# EasyEDA schematic Fyp_SCH_FINAL.json
TITLE: Sheet_1; REV: 1.0; Date: 2023-05-06; Sheet: 1/1; Drawn By: supunchira; Company: Your Company
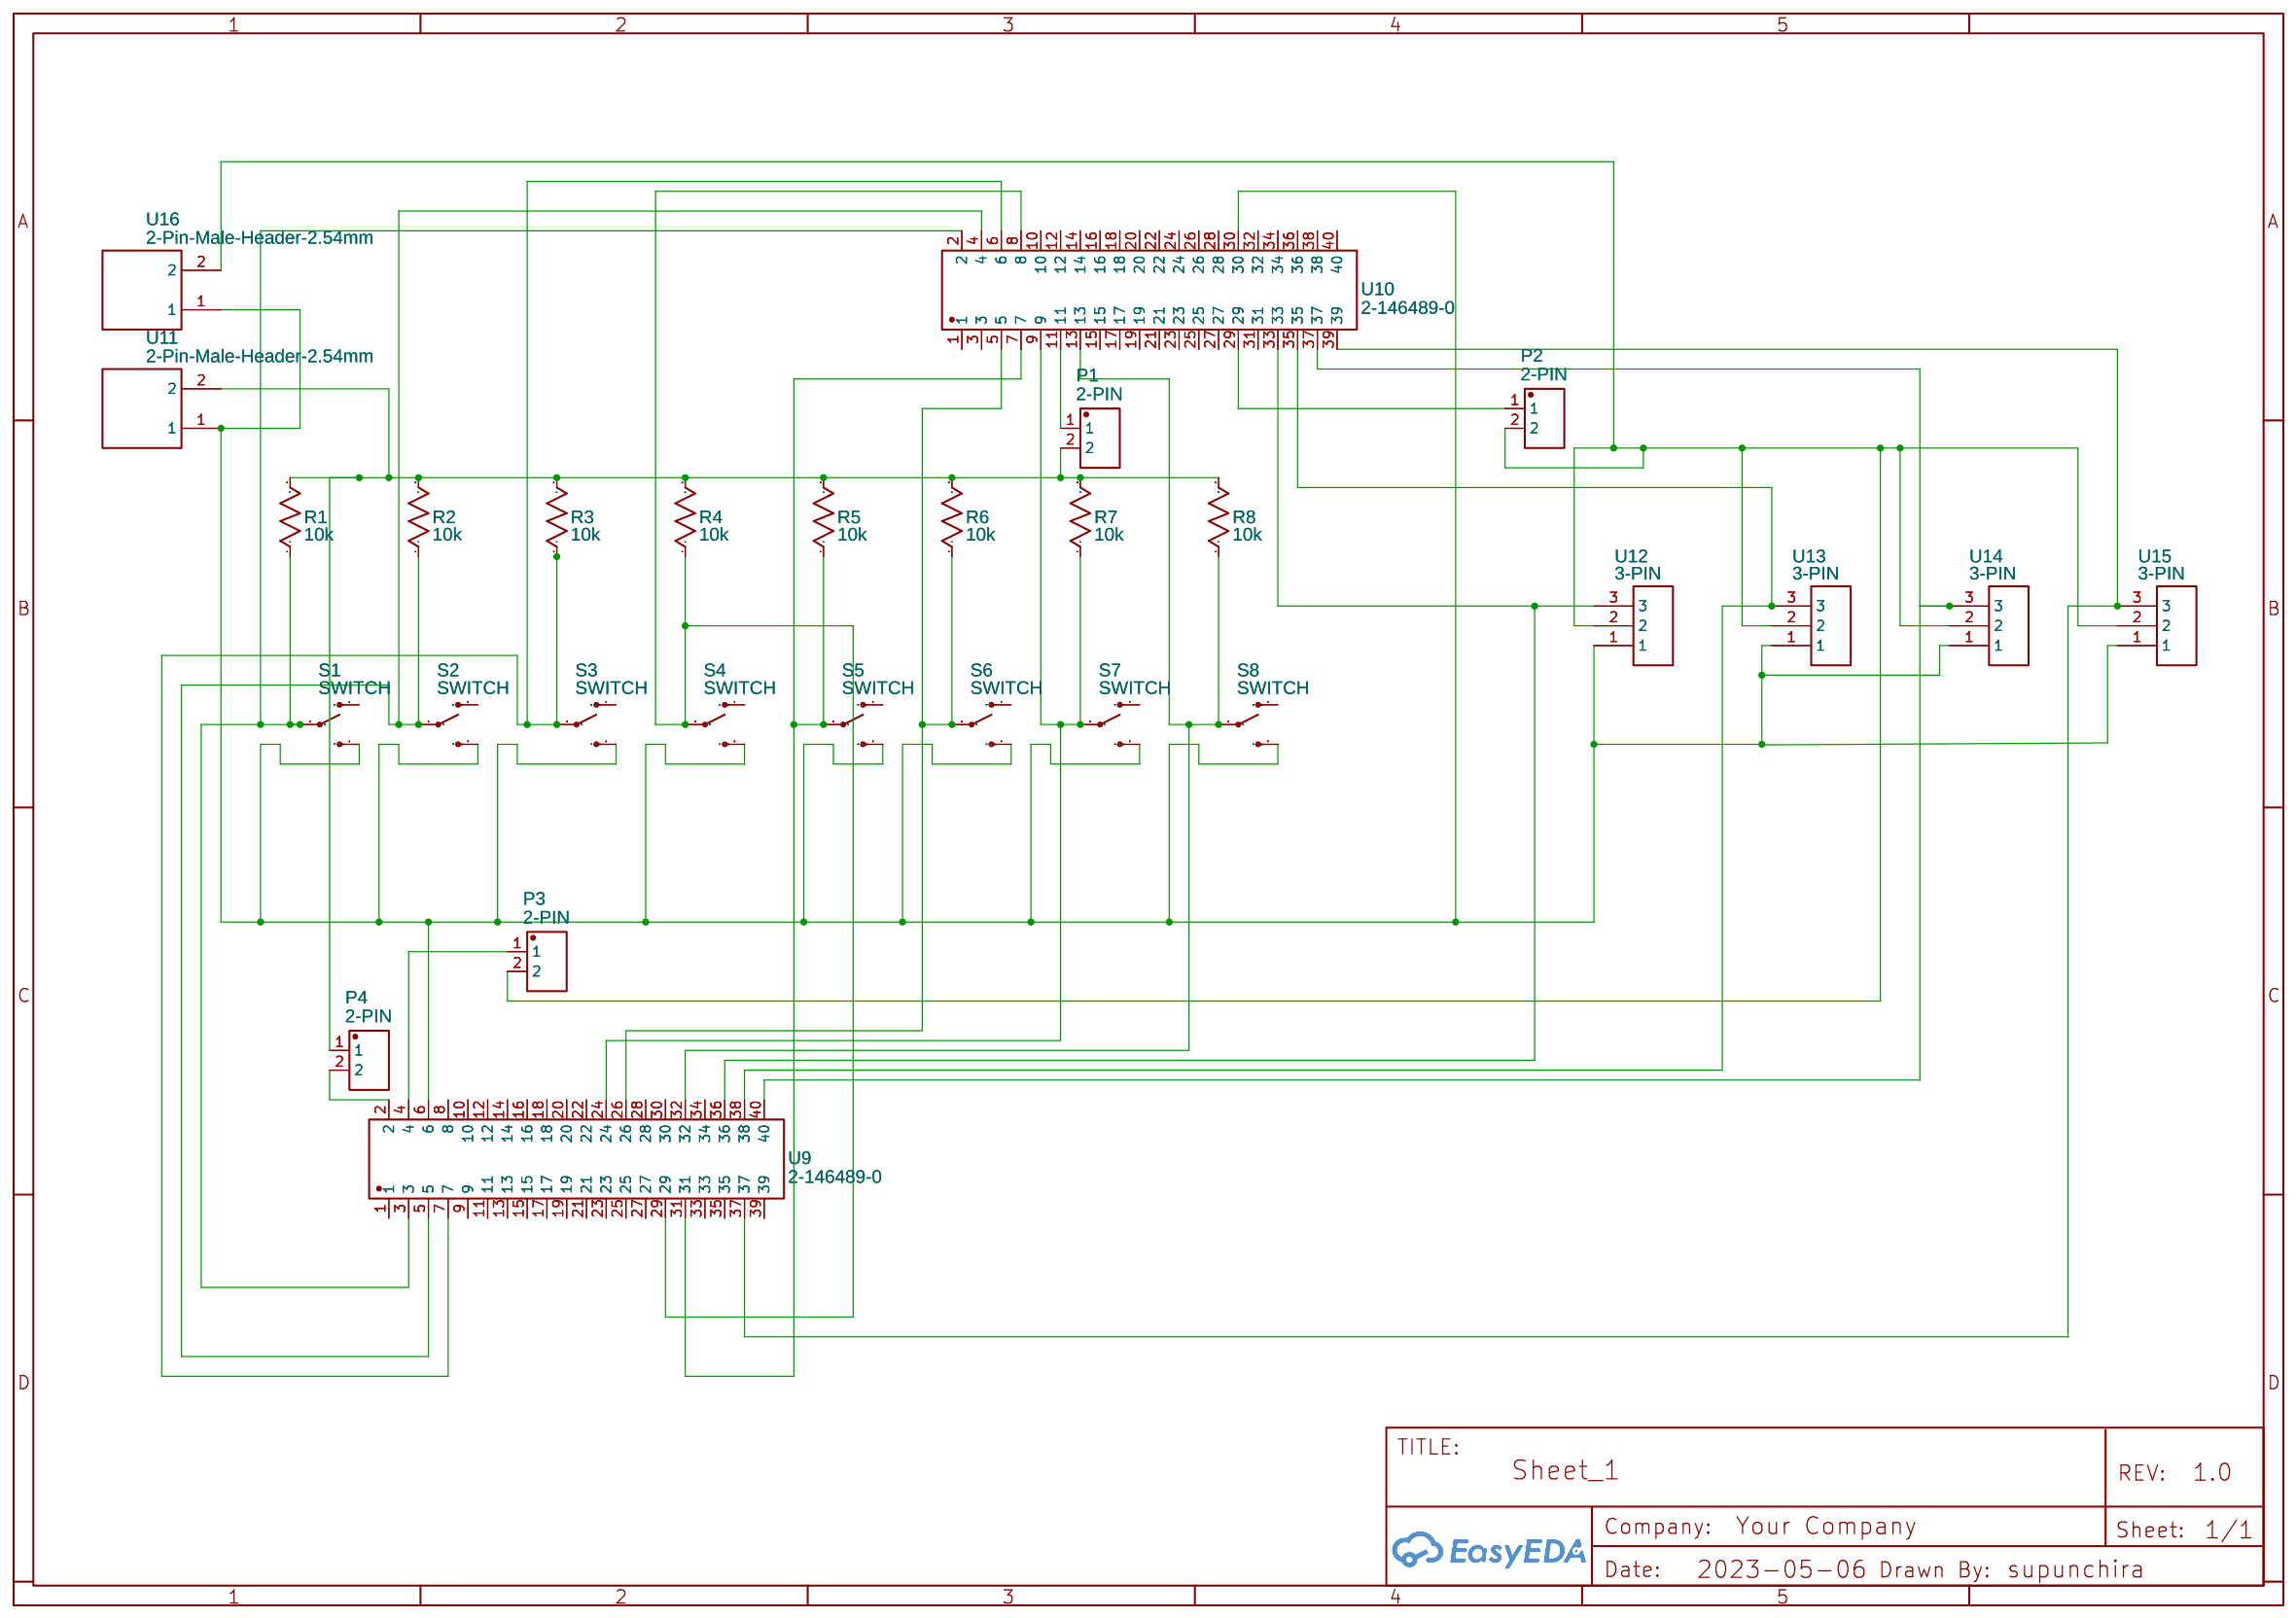
[diagram p0: schematic sheet]

## Parts
P1  2-PIN  [2-PIN-MALE-CONNECTOR]
P2  2-PIN  [2-PIN-MALE-CONNECTOR]
P3  2-PIN  [2-PIN-MALE-CONNECTOR]
P4  2-PIN  [2-PIN-MALE-CONNECTOR]
R1  10k  [R_AXIAL-0.3]
R2  10k  [R_AXIAL-0.3]
R3  10k  [R_AXIAL-0.3]
R4  10k  [R_AXIAL-0.3]
R5  10k  [R_AXIAL-0.3]
R6  10k  [R_AXIAL-0.3]
R7  10k  [R_AXIAL-0.3]
R8  10k  [R_AXIAL-0.3]
S1  SWITCH  [SWITCH-SPDT 3MM 10X5MM]
S2  SWITCH  [SWITCH-SPDT 3MM 10X5MM]
S3  SWITCH  [SWITCH-SPDT 3MM 10X5MM]
S4  SWITCH  [SWITCH-SPDT 3MM 10X5MM]
S5  SWITCH  [SWITCH-SPDT 3MM 10X5MM]
S6  SWITCH  [SWITCH-SPDT 3MM 10X5MM]
S7  SWITCH  [SWITCH-SPDT 3MM 10X5MM]
S8  SWITCH  [SWITCH-SPDT 3MM 10X5MM]
U9  2-146489-0  [HDR-TH_40P-P2.54-V-M-R2-C20-S2.54-2]
U10  2-146489-0  [HDR-TH_40P-P2.54-V-M-R2-C20-S2.54-2]
U11  2-Pin-Male-Header-2.54mm  [2-PIN-MALE-HEADER-2.54MM]
U12  3-PIN  [3-PIN 2.54]
U13  3-PIN  [3-PIN 2.54]
U14  3-PIN  [3-PIN 2.54]
U15  3-PIN  [3-PIN 2.54]
U16  2-Pin-Male-Header-2.54mm  [2-PIN-MALE-HEADER-2.54MM]

## Library data of the parts
P1-P4 = 2-PIN-MALE-CONNECTOR COPY: Supplier Part: C23595; Supplier: LCSC; Manufacturer: ReliaPro; Manufacturer Part: Terminals/WJ2EDGV-5.08-8P; image: //image.lceda.cn/szlcsc/C23595.jpg; Contributor: ilmanciobo
R1-R8 = R_AXIAL-0.3_US: Contributor: LCEDA_Lib; Package Display: No
S1-S8 = SWITCH-SPDT 3MM 10X5MM: SPDT Switch; Contributor: SparkFun
U9 U10 = 2-146489-0: Supplier: LCSC; Supplier Part: C3334839; Manufacturer: TE Connectivity(美国泰科); Contributor: lcsc
U11 U16 = 2-Pin-Male-Header-2.54mm: Contributor: zynctank
U12-U15 = 3-PIN: Contributor: felipecavallini11

## Nets
Net-(P1-1): P1.1 U10.11
Net-(P1-2): P1.2 P4.1 R1.2 R2.2 R3.2 R4.2 R5.2 R6.2 R7.2 R8.2 U11.2
Net-(P2-1): P2.1 U10.29
Net-(P2-2): P2.2 P3.2 U12.2 U13.2 U14.2 U15.2 U16.2
Net-(P3-1): P3.1 U9.4
Net-(P4-2): P4.2 U9.2
Net-(R1-1): R1.1 S1.2(P) U9.3 U10.2
Net-(R2-1): R2.1 S2.2(P) U9.5 U10.4
Net-(R3-1): R3.1 S3.2(P) U9.7 U10.6
Net-(R4-1): R4.1 S4.2(P) U9.29 U10.8
Net-(R5-1): R5.1 S5.2(P) U9.31 U10.7
Net-(R6-1): R6.1 S6.2(P) U9.26 U10.5
Net-(R7-1): R7.1 S7.2(P) U9.24 U10.9
Net-(R8-1): R8.1 S8.2(P) U9.32 U10.13
Net-(S1-3): S1.3(S) S2.3(S) S3.3(S) S4.3(S) S5.3(S) S6.3(S) S7.3(S) S8.3(S) U9.6 U10.30 U11.1 U12.1 U13.1 U14.1 U15.1 U16.1
Net-(U9-36): U9.36 U10.33 U12.3
Net-(U9-37): U9.37 U10.39 U15.3
Net-(U9-38): U9.38 U10.35 U13.3
Net-(U9-40): U9.40 U10.37 U14.3

Not connected (* = marked no-connect by the designer): S1 1(O); S2 1(O); S3 1(O); S4 1(O); S5 1(O); S6 1(O); S7 1(O); S8 1(O); U9 1 8 9 10 11 12 13 14 15 16 17 18 19 20 21 22 23 25 27 28 30 33 34 35 39; U10 1 3 10 12 14 15 16 17 18 19 20 21 22 23 24 25 26 27 28 31 32 34 36 38 40
